# EAGLE design carte_mère (EAGLE 9.6.2)
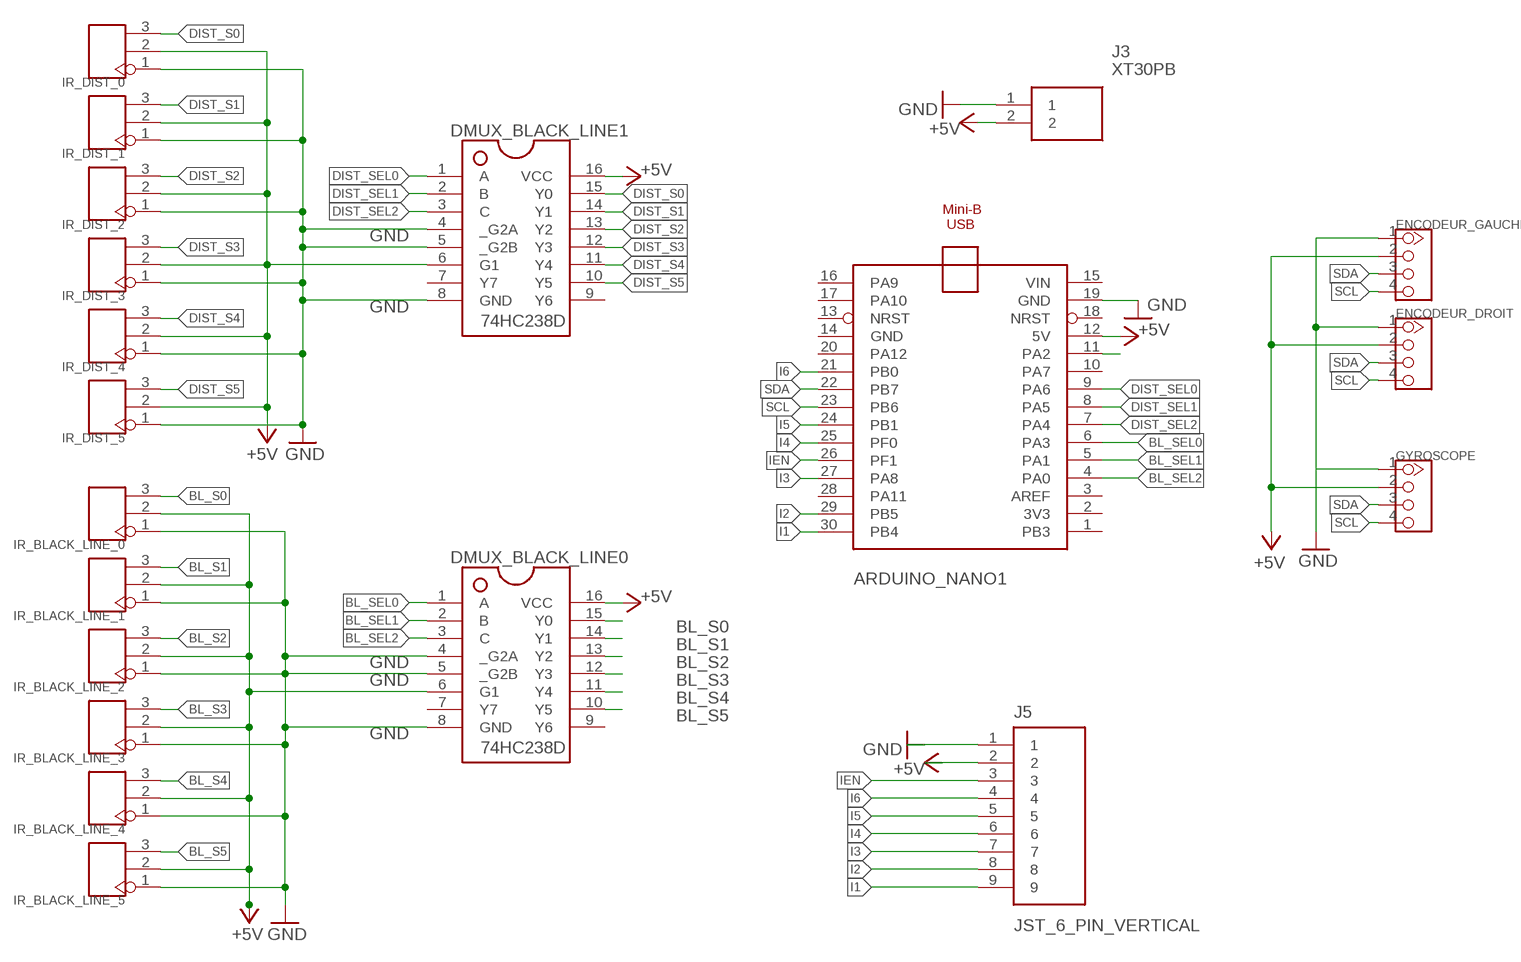
[diagram p0: schematic, sheet 1]

## Parts
ARDUINO_NANO1  NUCLEO_F303K8  [NUCLEO_F303K8]
DMUX_BLACK_LINE0  74HC238D  [SOIC127P600X175-16N]
DMUX_BLACK_LINE1  74HC238D  [SOIC127P600X175-16N]
ENCODEUR_DROIT  TWIG-4P-2.0'90D'  [4P-2.0-90D]
ENCODEUR_GAUCHE  TWIG-4P-2.0'90D'  [4P-2.0-90D]
GYROSCOPE  TWIG-4P-2.0'90D'  [4P-2.0-90D]
IR_BLACK_LINE_0  HEADER-3P-2.54  [3P-2.54]
IR_BLACK_LINE_1  HEADER-3P-2.54  [3P-2.54]
IR_BLACK_LINE_2  HEADER-3P-2.54  [3P-2.54]
IR_BLACK_LINE_3  HEADER-3P-2.54  [3P-2.54]
IR_BLACK_LINE_4  HEADER-3P-2.54  [3P-2.54]
IR_BLACK_LINE_5  HEADER-3P-2.54  [3P-2.54]
IR_DIST_0  HEADER-3P-2.54  [3P-2.54]
IR_DIST_1  HEADER-3P-2.54  [3P-2.54]
IR_DIST_2  HEADER-3P-2.54  [3P-2.54]
IR_DIST_3  HEADER-3P-2.54  [3P-2.54]
IR_DIST_4  HEADER-3P-2.54  [3P-2.54]
IR_DIST_5  HEADER-3P-2.54  [3P-2.54]
J3  XT30PB  [XT30PB]
J5  JST_6_PIN_VERTICAL  [JST-6-SMD-VERT-1.0MM]

## Nets
+5V: ARDUINO_NANO1.12(5V) DMUX_BLACK_LINE0.6(G1) DMUX_BLACK_LINE0.16(VCC) DMUX_BLACK_LINE1.6(G1) DMUX_BLACK_LINE1.16(VCC) ENCODEUR_DROIT.2 ENCODEUR_GAUCHE.2 GYROSCOPE.2 IR_BLACK_LINE_0.2 IR_BLACK_LINE_1.2 IR_BLACK_LINE_2.2 IR_BLACK_LINE_3.2 IR_BLACK_LINE_4.2 IR_BLACK_LINE_5.2 IR_DIST_0.2 IR_DIST_1.2 IR_DIST_2.2 IR_DIST_3.2 IR_DIST_4.2 IR_DIST_5.2 J3.2 J5.2
BL_S0: DMUX_BLACK_LINE0.15(Y0) IR_BLACK_LINE_0.3
BL_S1: DMUX_BLACK_LINE0.14(Y1) IR_BLACK_LINE_1.3
BL_S2: DMUX_BLACK_LINE0.13(Y2) IR_BLACK_LINE_2.3
BL_S3: DMUX_BLACK_LINE0.12(Y3) IR_BLACK_LINE_3.3
BL_S4: DMUX_BLACK_LINE0.11(Y4) IR_BLACK_LINE_4.3
BL_S5: DMUX_BLACK_LINE0.10(Y5) IR_BLACK_LINE_5.3
BL_SEL0: ARDUINO_NANO1.6(PA3) DMUX_BLACK_LINE0.1(A)
BL_SEL1: ARDUINO_NANO1.5(PA1) DMUX_BLACK_LINE0.2(B)
BL_SEL2: ARDUINO_NANO1.4(PA0) DMUX_BLACK_LINE0.3(C)
DIST_S0: DMUX_BLACK_LINE1.15(Y0) IR_DIST_0.3
DIST_S1: DMUX_BLACK_LINE1.14(Y1) IR_DIST_1.3
DIST_S2: DMUX_BLACK_LINE1.13(Y2) IR_DIST_2.3
DIST_S3: DMUX_BLACK_LINE1.12(Y3) IR_DIST_3.3
DIST_S4: DMUX_BLACK_LINE1.11(Y4) IR_DIST_4.3
DIST_S5: DMUX_BLACK_LINE1.10(Y5) IR_DIST_5.3
DIST_SEL0: ARDUINO_NANO1.9(PA6) DMUX_BLACK_LINE1.1(A)
DIST_SEL1: ARDUINO_NANO1.8(PA5) DMUX_BLACK_LINE1.2(B)
DIST_SEL2: ARDUINO_NANO1.7(PA4) DMUX_BLACK_LINE1.3(C)
GND: ARDUINO_NANO1.19(GND) DMUX_BLACK_LINE0.4(_G2A) DMUX_BLACK_LINE0.5(_G2B) DMUX_BLACK_LINE0.8(GND) DMUX_BLACK_LINE1.4(_G2A) DMUX_BLACK_LINE1.5(_G2B) DMUX_BLACK_LINE1.8(GND) ENCODEUR_DROIT.1 ENCODEUR_GAUCHE.1 GYROSCOPE.1 IR_BLACK_LINE_0.1 IR_BLACK_LINE_1.1 IR_BLACK_LINE_2.1 IR_BLACK_LINE_3.1 IR_BLACK_LINE_4.1 IR_BLACK_LINE_5.1 IR_DIST_0.1 IR_DIST_1.1 IR_DIST_2.1 IR_DIST_3.1 IR_DIST_4.1 IR_DIST_5.1 J3.1 J5.1
I1: ARDUINO_NANO1.30(PB4) J5.9
I2: ARDUINO_NANO1.29(PB5) J5.8
I3: ARDUINO_NANO1.27(PA8) J5.7
I4: ARDUINO_NANO1.25(PF0) J5.6
I5: ARDUINO_NANO1.24(PB1) J5.5
I6: ARDUINO_NANO1.21(PB0) J5.4
IEN: ARDUINO_NANO1.26(PF1) J5.3
N$1: ARDUINO_NANO1.11(PA2)
SCL: ARDUINO_NANO1.23(PB6) ENCODEUR_DROIT.4 ENCODEUR_GAUCHE.4 GYROSCOPE.4
SDA: ARDUINO_NANO1.22(PB7) ENCODEUR_DROIT.3 ENCODEUR_GAUCHE.3 GYROSCOPE.3
Unconnected: ARDUINO_NANO1.1(PB3) ARDUINO_NANO1.2(3V3) ARDUINO_NANO1.3(AREF) ARDUINO_NANO1.10(PA7) ARDUINO_NANO1.13(NRST) ARDUINO_NANO1.16(PA9) ARDUINO_NANO1.17(PA10) ARDUINO_NANO1.18(NRST) ARDUINO_NANO1.20(PA12) ARDUINO_NANO1.28(PA11) DMUX_BLACK_LINE0.7(Y7) DMUX_BLACK_LINE0.9(Y6) DMUX_BLACK_LINE1.7(Y7) DMUX_BLACK_LINE1.9(Y6)

## Power pins joined to a net without a drawn wire
GND: ARDUINO_NANO1.14(GND)
VIN: ARDUINO_NANO1.15(VIN)

## Library data of the parts
ARDUINO_NANO1 = nucleo_F303K8:NUCLEO_F303K8: Arduino Nano V3.0 Overview: The Arduino Nano is a small, complete, and breadboard-friendly board based on the ATmega328 (Arduino Nano 3.x) or ATmega168 (Arduino Nano 2.x). It has more or less the same functionality of the Arduino Duemilanove, but in a different package. It lacks only a DC power jack, and works with a Mini-B USB cable instead of a standard one. The Nano was designed and is being produced by Gravitech. Specifications: Microcontroller Atmel ATmega168 or ATmega328 Operating Voltage (logic level) 5 V Input Voltage (recommended) 7-12 V Input Voltage (limits) 6-20 V Digital I/O Pins 14 (of which 6 provide PWM output) Analog Input Pins 8 DC Current per I/O Pin 40 mA Flash Memory 16 KB (ATmega168) or 32 KB (ATmega328) of which 2 KB used by bootloader SRAM 1 KB (ATmega168) or 2 KB (ATmega328) EEPROM 512 bytes (ATmega168) or 1 KB (ATmega328) Clock Speed 16 MHz Dimensions 0.73" x 1.70" Length 45 mm Width 18 mm Weigth 5 g Power: The Arduino Nano can be powered via the Mini-B USB connection, 6-20V unregulated external power supply (pin 30), or 5V regulated external power supply (pin 27). The power source is automatically selected to the highest voltage source. Memory: The ATmega168 has 16 KB of flash memory for storing code (of which 2 KB is used for the bootloader); the ATmega328 has 32 KB, (also with 2 KB used for the bootloader). The ATmega168 has 1 KB of SRAM and 512 bytes of EEPROM (which can be read and written with the EEPROM library); the ATmega328 has 2 KB of SRAM and 1 KB of EEPROM. Input and Output: Each of the 14 digital pins on the Nano can be used as an input or output, using pinMode(), digitalWrite(), and digitalRead() functions. They operate at 5 volts. Each pin can provide or receive a maximum of 40 mA and has an internal pull-up resistor (disconnected by default) of 20-50 kOhms. In addition, some pins have specialized functions. Visit Arduino - ArduinoBoardNano <https://www.arduino.cc/en/Main/ArduinoBoardNano>
DMUX_BLACK_LINE0 DMUX_BLACK_LINE1 = SOIC127P600X175-16N:74HC238D
ENCODEUR_DROIT ENCODEUR_GAUCHE GYROSCOPE = ConnectorGrove:TWIG-4P-2.0
IR_BLACK_LINE_0 IR_BLACK_LINE_1-IR_BLACK_LINE_5 IR_DIST_0 IR_DIST_1-IR_DIST_5 = ConnectorGrove:HEADER-3P
J3 = XT30PB:XT30PB: Mini XT60 XT30 Connector for RC Multirotor Racing Drone Quadcopter Source: Datasheet <https://www.tme.eu/Document/4acc913878197f8c2e30d4b8cdc47230/XT30UPB SPEC.pdf>; DESCRIPTION: Mini XT60 XT30 Connector for RC Multirotor Racing Drone Quadcopter; HEIGHT: 10.7mm; MANUFACTURER_NAME: Amass; MANUFACTURER_PART_NUMBER: XT30PB
J5 = SparkFun-Connectors_JST_SH:JST_6_PIN_VERTICAL: JST 6 pin vertical connector Here is a six pin vertical 1.0mm pitch connector. It is useful if you need something very tiny as a connection. These are not the standard JST type connectors we use on most of our boards, but are actually the much smaller JST-SH type. Here is the connector we sell at SparkFun: JST SH Vertical 6-Pin Connector - SMD <https://www.sparkfun.com/products/579> (GPS-00579) Datasheet <http://www.sparkfun.com/datasheets/GPS/EM406-SMDConnector-eSH.pdf> It was used on these SparkFun products: SparkFun GPS Breakout <https://www.sparkfun.com/products/11818> (BOB-11818) SparkFun Weather Shield <https://www.sparkfun.com/products/12081> (DEV-12081) And many, many other GPS related products.; PROD_ID: CONN-08249; SF_ID: GPS-00579

## Board
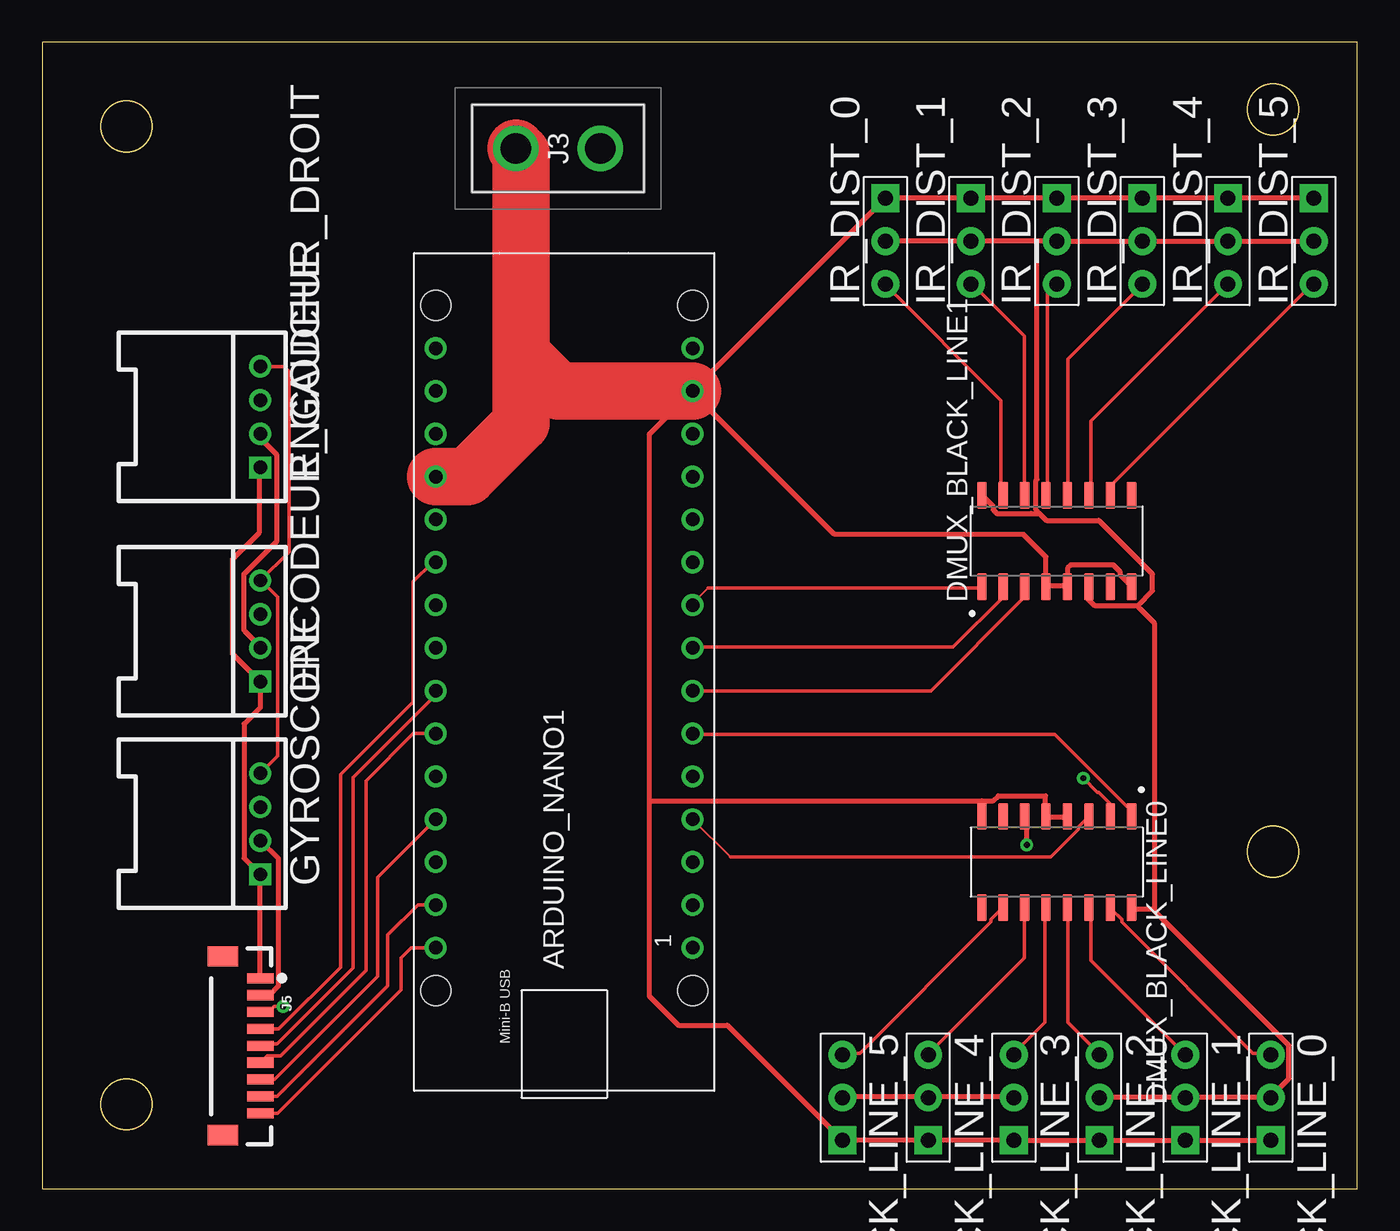
[diagram p1: board, top side]
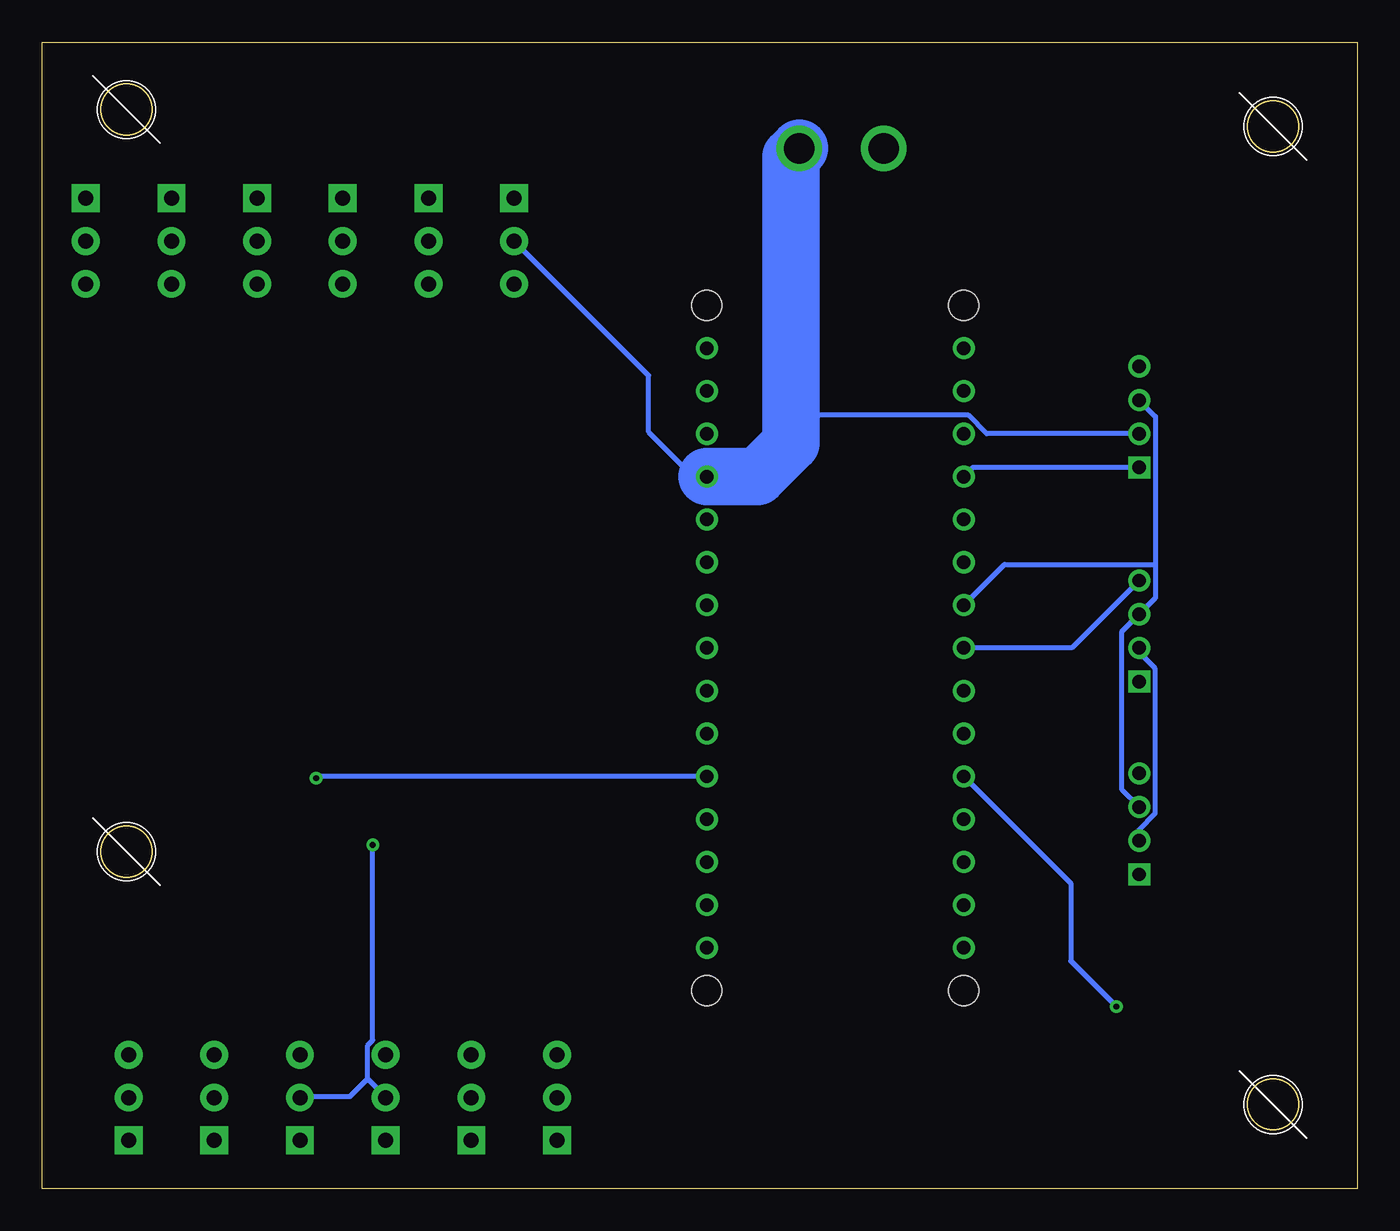
[diagram p2: board, bottom side, seen from below]

Size 78 x 68 mm. Coordinates in mm from the lower left corner, seen from the top.
Outline: 0,0 78,0 78,68 0,68 0,0
Outline: circle at 5,5 radius 1.5
Outline: circle at 73,20 radius 1.5
Outline: circle at 73,64 radius 1.5
Outline: circle at 5,63 radius 1.5
Copper layers (1*16): Top 0.035mm / dielectric 1.5mm / Bottom 0.035mm
Design rules "default": minimum track width 6mil, minimum drill 0.35mm, track to track 6mil, track to pad 6mil, pad to pad 6mil, via to via 6mil, smd to smd 6mil, copper to edge 40mil, drill to drill 6mil, minimum pad ring 10mil, minimum via ring 8mil, stop-mask expansion 4mil, vias tented up to drill 0mil, thermal gap 10mil

### Footprints (pad centres in the part's own frame; a part is rotated, then mirrored left to right if it is on the bottom)
NUCLEO_F303K8 = drill 0.8: 1 0,0; 2 2.54,0; 3 5.08,0; 4 7.62,0; 5 10.16,0; 6 12.7,0; 7 15.24,0; 8 17.78,0; 9 20.32,0; 10 22.86,0; 11 25.4,0; 12 27.94,0; 13 30.48,0; 14 33.02,0; 15 35.56,0; 16 35.56,15.24; 17 33.02,15.24; 18 30.48,15.24; 19 27.94,15.24; 20 25.4,15.24; 21 22.86,15.24; 22 20.32,15.24; 23 17.78,15.24; 24 15.24,15.24; 25 12.7,15.24; 26 10.16,15.24; 27 7.62,15.24; 28 5.08,15.24; 29 2.54,15.24; 30 0,15.24 | hole 1.778: -2.54,0; -2.54,15.24; 38.1,15.24; 38.1,0
SOIC127P600X175-16N = smd 1.59 x 0.57: 1 -2.71,4.445; 2 -2.71,3.175; 3 -2.71,1.905; 4 -2.71,0.635; 5 -2.71,-0.635; 6 -2.71,-1.905; 7 -2.71,-3.175; 8 -2.71,-4.445; 9 2.71,-4.445; 10 2.71,-3.175; 11 2.71,-1.905; 12 2.71,-0.635; 13 2.71,0.635; 14 2.71,1.905; 15 2.71,3.175; 16 2.71,4.445
4P-2.0-90D = drill 0.8 pad 1.27 square: 1 -3,0 | drill 0.8 pad 1.27: 2 -1,0; 3 1,0; 4 3,0
3P-2.54 = drill 0.889 pad 1.651 square: 1 0,2.54 | drill 0.889 pad 1.651: 2 0,0; 3 0,-2.54
XT30PB = drill 1.8 pad 2.7: 1 0,0; 2 0,-5
JST-6-SMD-VERT-1.0MM = smd 0.6 x 1.55: 1 -3.54,1.27; 2 -2.54,1.27; 3 -1.54,1.27; 4 -0.54,1.27; 5 0.46,1.27; 6 1.46,1.27; 7 2.46,1.27; 8 3.46,1.27; 9 4.46,1.27 | smd 1.2 x 1.8: P$1 -4.84,-0.955; P$2 5.76,-0.955

### Placement (x,y rotation side)
ARDUINO_NANO1  38.58,14.29 90 top
DMUX_BLACK_LINE0  60.17,19.37 270 top
DMUX_BLACK_LINE1  60.17,38.42 90 top
ENCODEUR_DROIT  12.94,45.77 90 top
ENCODEUR_GAUCHE  12.94,33.07 90 top
GYROSCOPE  12.94,21.64 90 top
IR_BLACK_LINE_0  72.87,5.4 180 top
IR_BLACK_LINE_1  67.79,5.4 180 top
IR_BLACK_LINE_2  62.71,5.4 180 top
IR_BLACK_LINE_3  57.63,5.4 180 top
IR_BLACK_LINE_4  52.55,5.4 180 top
IR_BLACK_LINE_5  47.47,5.4 180 top
IR_DIST_0  50.01,56.2 0 top
IR_DIST_1  55.09,56.2 0 top
IR_DIST_2  60.17,56.2 0 top
IR_DIST_3  65.25,56.2 0 top
IR_DIST_4  70.33,56.2 0 top
IR_DIST_5  75.41,56.2 0 top
J3  28.1,61.7 90 top
J5  11.67,8.94 270 top

### Tracks (layer width: path | path; a pad name or v marks a point on that pad's centre or on a via)
+5V  (via drill 0.35)
  Top 0.3: 65.86,16.58 65.25,16.58 64.64,16.58 DMUX_BLACK_LINE0.16 | 65.86,16.58 65.95,16.58 65.95,33.55 64.94,34.56 | 65.86,16.58 73.94,8.5 73.94,6.52 72.87,5.45 | IR_BLACK_LINE_5.2 47.57,5.45 52.45,5.45 IR_BLACK_LINE_4.2 52.6,5.45 57.63,5.45 IR_BLACK_LINE_3.2 | v58.39,20.39 58.39,22.06 DMUX_BLACK_LINE0.6 | IR_BLACK_LINE_2.2 62.81,5.45 67.69,5.45 IR_BLACK_LINE_1.2 67.84,5.45 72.87,5.45 | 72.87,5.45 IR_BLACK_LINE_0.2 | 13.35,11.48 J5.2 13.48,11.48 14.02,12.02 14.02,19.56 GYROSCOPE.2 | 64.94,34.56 65.85,35.46 65.85,36.44 62.66,39.63 59.57,39.63 59.15,40.05 59,40.05 | ENCODEUR_GAUCHE.2 12.94,32.16 12.05,33.05 | 12.05,33.05 | ENCODEUR_DROIT.2 12.94,44.51 13.9,43.55 13.9,38.38 11.97,36.46 11.97,33.12 12.05,33.05 | DMUX_BLACK_LINE1.16 56.41,40.45 56.41,40.25 56.63,40.03 58.63,40.03 58.65,40.05 59,40.05 | 59,40.05 59,40.2 58.95,40.25 58.95,42.01 59,42.06 59,56.2 | 59,56.2 IR_DIST_2.2 IR_DIST_3.2 IR_DIST_4.2 IR_DIST_5.2 | 59,56.2 IR_DIST_1.2 IR_DIST_0.2 | DMUX_BLACK_LINE1.6 62,35.63 62,35 62.44,34.56 64.94,34.56
  Bottom 0.3: v58.39,20.39 58.39,8.8 58.7,8.5 58.7,6.52 | 58.7,6.52 57.63,5.45 IR_BLACK_LINE_3.2 | 58.7,6.52 59.76,5.45 62.66,5.45 IR_BLACK_LINE_2.2 | GYROSCOPE.2 12.94,21.29 11.98,22.24 11.98,30.85 12.94,31.81 ENCODEUR_GAUCHE.2 | ENCODEUR_DROIT.2 21.99,44.77 21.99,44.8 23.07,45.88 31.93,45.88 33.58,44.23 | IR_DIST_0.2 42.04,48.23 42.04,44.87 39.39,42.23 ARDUINO_NANO1.12
  Bottom 3.4: ARDUINO_NANO1.12 35.58,42.23 33.58,44.23 33.58,61.22 J3.2
BL_S0
  Top 0.2: DMUX_BLACK_LINE0.15 63.42,16.58 64.03,15.97 64.03,15.81 71.8,8.04 72.87,8.04 IR_BLACK_LINE_0.3
BL_S1
  Top 0.2: IR_BLACK_LINE_1.3 62.2,13.53 62.2,16.58 DMUX_BLACK_LINE0.14
BL_S2
  Top 0.2: DMUX_BLACK_LINE0.13 60.83,16.58 60.83,9.87 62.66,8.04 IR_BLACK_LINE_2.3
BL_S3
  Top 0.2: DMUX_BLACK_LINE0.12 59.46,16.58 59.46,9.87 57.63,8.04 IR_BLACK_LINE_3.3
BL_S4
  Top 0.2: DMUX_BLACK_LINE0.11 58.24,16.58 58.24,13.68 52.6,8.04 IR_BLACK_LINE_4.3
BL_S5
  Top 0.2: DMUX_BLACK_LINE0.10 56.87,16.58 56.26,15.97 56.26,15.81 48.49,8.04 47.57,8.04 IR_BLACK_LINE_5.3
BL_SEL0
  Top 0.152: 38.58,26.94 ARDUINO_NANO1.6
  Top 0.2: 38.58,26.94 60.07,26.94 64.49,22.52 64.49,22.21 DMUX_BLACK_LINE0.1
BL_SEL1  (via drill 0.35)
  Top 0.2: DMUX_BLACK_LINE0.2 63.34,22.83 62.66,23.51 62.59,23.51 v61.74,24.35
  Bottom 0.3: ARDUINO_NANO1.5 61.64,24.45 v61.74,24.35
BL_SEL2
  Top 0.152: ARDUINO_NANO1.4 40.81,19.68
  Top 0.2: 40.81,19.68 59.82,19.68 61.44,21.3 61.44,21.45 62.05,22.06 DMUX_BLACK_LINE0.3
DIST_S0
  Top 0.2: DMUX_BLACK_LINE1.15 56.87,41.27 56.87,46.75 50.01,53.61 IR_DIST_0.3
DIST_S1
  Top 0.2: DMUX_BLACK_LINE1.14 58.24,41.27 58.24,50.56 55.19,53.61 IR_DIST_1.3
DIST_S2
  Top 0.2: DMUX_BLACK_LINE1.13 59.61,41.27 59.61,53.15 60.07,53.61 IR_DIST_2.3
DIST_S3
  Top 0.2: DMUX_BLACK_LINE1.12 60.83,41.27 60.83,49.19 65.25,53.61 IR_DIST_3.3
DIST_S4
  Top 0.2: IR_DIST_4.3 62.2,45.53 62.2,41.27 DMUX_BLACK_LINE1.11
DIST_S5
  Top 0.2: DMUX_BLACK_LINE1.10 63.42,41.27 63.42,41.72 75.31,53.61 IR_DIST_5.3
DIST_SEL0
  Top 0.152: 39.49,35.63 38.58,34.71 ARDUINO_NANO1.9
  Top 0.2: 39.49,35.63 55.65,35.63 DMUX_BLACK_LINE1.1
DIST_SEL1
  Top 0.152: 38.58,32.12 ARDUINO_NANO1.8
  Top 0.2: DMUX_BLACK_LINE1.2 56.99,35.1 54.02,32.12 38.58,32.12
DIST_SEL2
  Top 0.2: ARDUINO_NANO1.7 52.7,29.53 58.23,35.06 58.23,35.62 58.24,35.63 DMUX_BLACK_LINE1.3
GND
  Top 0.3: 64.49,35.78 DMUX_BLACK_LINE1.8 63.93,36.39 63.93,36.59 63.52,37 61,37 60.8,36.8 DMUX_BLACK_LINE1.5 60.68,35.78 59.6,35.78 DMUX_BLACK_LINE1.4 | 59.46,35.78 DMUX_BLACK_LINE1.4 | 60.83,22.21 DMUX_BLACK_LINE0.4 60.68,22.06 59.61,22.06 DMUX_BLACK_LINE0.5 59.5,22.11 59.5,23.3 56.7,23.3 56.4,23 55.73,23 | IR_BLACK_LINE_0.1 IR_BLACK_LINE_1.1 IR_BLACK_LINE_2.1 IR_BLACK_LINE_3.1 IR_BLACK_LINE_4.1 IR_BLACK_LINE_5.1 40.63,9.7 37.73,9.7 36,11.42 36,23 | ENCODEUR_DROIT.1 12.89,42.72 12.89,38.92 11.3,37.33 11.3,31.71 ENCODEUR_GAUCHE.1 12.94,28.53 11.97,27.57 11.97,19.61 GYROSCOPE.1 J5.1 | 55.65,22.21 DMUX_BLACK_LINE0.8 55.73,23 | IR_DIST_5.1 IR_DIST_4.1 65.3,58.74 65.25,58.79 IR_DIST_3.1 IR_DIST_2.1 IR_DIST_1.1 IR_DIST_0.1 ARDUINO_NANO1.14 | DMUX_BLACK_LINE1.4 59.53,37.47 58.2,38.8 47,38.8 38.58,47.22 ARDUINO_NANO1.14 | ARDUINO_NANO1.14 36,44.73 36,23 | 36,23 55.73,23
  Top 3.4: ARDUINO_NANO1.14 30.63,47.31 28.4,49.54 | ARDUINO_NANO1.19 25.24,42.23 28.4,45.39 28.4,49.54 | 28.2,61.6 J3.1 28.4,61.4 28.4,51.54 28.4,49.54
  Bottom 0.3: ENCODEUR_DROIT.1 22.8,42.77 ARDUINO_NANO1.19
I1
  Top 0.2: 13.04,4.62 J5.9 13.98,4.48 21.29,11.79 21.29,13.69 21.89,14.29 ARDUINO_NANO1.30
I2
  Top 0.2: 13.04,5.54 J5.8 13.94,5.48 20.5,12.04 20.5,15.04 22.29,16.83 ARDUINO_NANO1.29
I3
  Top 0.2: 13.04,6.6 J5.7 13.78,6.48 19.9,12.6 19.9,18.47 ARDUINO_NANO1.27
I4
  Top 0.2: 13.04,7.52 J5.6 13.34,7.88 14.14,7.88 19.2,12.94 19.2,24.18 22.01,26.99 | ARDUINO_NANO1.25 22.01,26.99 | 22,27 22.01,26.99
I5
  Top 0.2: J5.5 13.04,8.58 13.94,8.58 18.45,13.09 18.45,24.39 23.34,29.28 ARDUINO_NANO1.24
I6
  Top 0.2: J5.4 14.04,9.48 17.7,13.13 17.7,24.57 22,28.88 22,36 23.15,37.15 ARDUINO_NANO1.21
IEN  (via drill 0.35)
  Top 0.2: v14.3,10.8 13.76,10.8 13.44,10.48 J5.3
  Bottom 0.3: ARDUINO_NANO1.26 17,18.11 17,13.5 v14.3,10.8
SCL
  Top 0.2: GYROSCOPE.4 13.96,25.66 13.96,35.1 13.04,36.02 ENCODEUR_GAUCHE.4 14.63,37.77 14.63,48.46 14.33,48.77 ENCODEUR_DROIT.4
  Bottom 0.3: ENCODEUR_GAUCHE.4 16.94,32.07 ARDUINO_NANO1.23
SDA
  Bottom 0.152: 12.89,46.68 ENCODEUR_DROIT.3
  Bottom 0.3: GYROSCOPE.3 13.96,23.66 13.96,33.05 ENCODEUR_GAUCHE.3 11.97,35.03 11.97,37 | 11.97,37 11.97,45.8 ENCODEUR_DROIT.3 | ARDUINO_NANO1.22 20.92,37.03 12,37.03 11.97,37